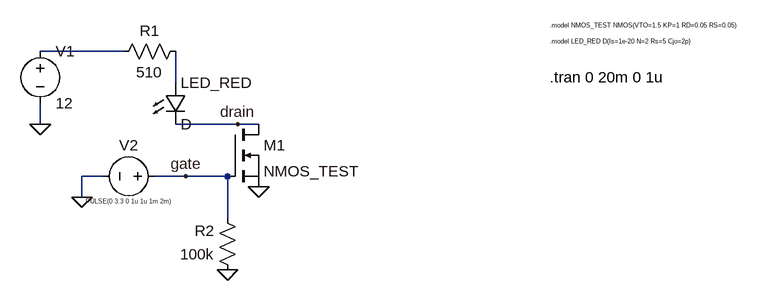
[diagram p0: schematic RGBW_LED_Test_Simulink_PWM.asc]
RGBW_LED_Test_Simulink_PWM.asc, the LTspice schematic file:
Version 4.1
SHEET 1 1052 680
WIRE 96 128 -32 128
WIRE 176 176 176 128
WIRE -32 240 -32 208
WIRE 272 240 176 240
WIRE 304 240 272 240
WIRE 64 320 32 320
WIRE 192 320 144 320
WIRE 256 320 192 320
WIRE 32 352 32 320
WIRE 256 384 256 320
FLAG -32 240 0
FLAG 304 336 0
FLAG 32 352 0
FLAG 256 464 0
FLAG 192 320 gate
FLAG 272 240 drain
SYMBOL voltage -32 112 R0
WINDOW 123 0 0 Left 0
WINDOW 39 0 0 Left 0
SYMATTR InstName V1
SYMATTR Value 12
SYMBOL res 192 112 R90
WINDOW 0 0 56 VBottom 2
WINDOW 3 32 56 VTop 2
SYMATTR InstName R1
SYMATTR Value 510
SYMBOL LED 160 176 R0
SYMATTR InstName LED_RED
SYMBOL nmos 256 240 R0
SYMATTR InstName M1
SYMATTR Value NMOS_TEST
SYMBOL res 272 480 R180
WINDOW 0 36 76 Left 2
WINDOW 3 36 40 Left 2
SYMATTR InstName R2
SYMATTR Value 100k
SYMBOL voltage 160 320 R90
WINDOW 0 -32 56 VBottom 2
WINDOW 3 32 56 VTop 0
WINDOW 123 0 0 Left 0
WINDOW 39 0 0 Left 0
SYMATTR InstName V2
SYMATTR Value PULSE(0 3.3 0 1u 1u 1m 2m)
TEXT 752 88 Left 0 !.model NMOS_TEST NMOS(VTO=1.5 KP=1 RD=0.05 RS=0.05)
TEXT 752 112 Left 0 !.model LED_RED D(Is=1e-20 N=2 Rs=5 Cjo=2p)
TEXT 752 168 Left 2 !.tran 0 20m 0 1u

The netlist it stands for:
* RGBW_LED_Test_Simulink_PWM.asc
V1 N001 0 12
R1 N002 N001 510
D§LED_RED N002 drain D
M1 drain gate 0 0 NMOS_TEST
R2 0 gate 100k
V2 gate 0 PULSE(0 3.3 0 1u 1u 1m 2m)
.model D D
.lib standard.dio
.model NMOS NMOS
.model PMOS PMOS
.lib standard.mos
.model NMOS_TEST NMOS(VTO=1.5 KP=1 RD=0.05 RS=0.05)
.model LED_RED D(Is=1e-20 N=2 Rs=5 Cjo=2p)
.tran 0 20m 0 1u
.backanno
.end